# Altium project PCB_Project.PrjPcb
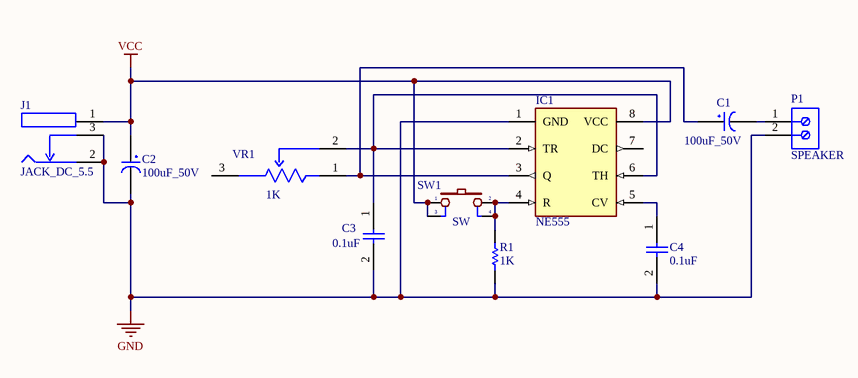
[diagram p0: Schematic.SchDoc]
1 sheet, 10 parts. Net scope: global (net labels, ports and power ports of the same name join across sheets).
Board file: PCB1.PcbDoc

## Sheet Schematic.SchDoc
size A4; SheetNumber: 1; SheetTotal: 1

### Parts
C1  100uF_50V  [CAP_ELEC_100uF_50V]
C2  100uF_50V  [CAP_ELEC_100uF_50V]
C3  0.1uF  [CAP_CER_105]
C4  0.1uF  [CAP_CER_105]
IC1  NE555  [DIP8]
J1  JACK_DC_5.5  [DC5.5/2.1]
P1  SPEAKER  [DOMINO_2]
R1  1K  [R1/4W]
SW1  SW  [SW4_2]
VR1  1K  [VR_VOLUME]

### Nets
GND: C2.2 C3.2 C4.2 IC1.1(GND) J1.2 J1.3 P1.2 R1.2
VCC: C2.1 IC1.8(VCC) J1.1 SW1.1 SW1.3
NetC1_1: C1.1 IC1.3(Q) VR1.1
NetC1_2: C1.2 P1.1
NetC3_1: C3.1 IC1.2(TR) IC1.6(TH) VR1.2
NetC4_1: C4.1 IC1.5(CV)
NetIC1_4: IC1.4(R) R1.1 SW1.2 SW1.4

Not connected (* = marked no-connect by the designer): IC1 7(DC); VR1 3

### Library data of the parts
C1 C2 = CAP_ELEC_100uF_50V: Electrolytic Capacitor 100uF 50V
C3 C4 = CAP_CER_105: Capacitor Ceramic 105 1uF; Value: *
IC1 = NE555: 555 Type, Timer/Oscillator (Single) IC 500kHz 8-DIP
J1 = JACK_DC_5.5: Jack DC 5.5x2.1
P1 = DOMINO_2: Domino 2
R1 = RES_1K_1/4W: Resistor Through-Hole  1K 1/4W; Value: *
SW1 = SW4: Switch button 4 pin; Value: SW chip 4 pin
VR1 = VR_Volume 1K: Variable_Resistor Volume 1K